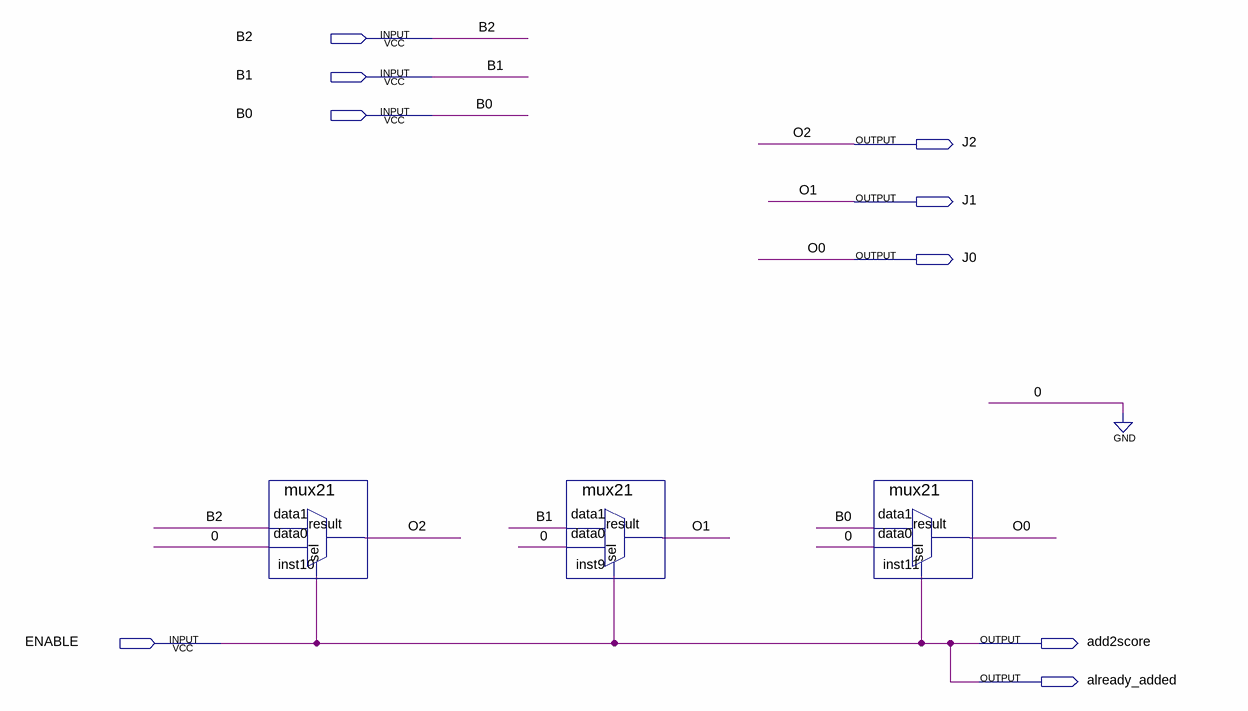
[diagram p0: schematic sheet]
// Quartus schematic add_or_not.bdf as structural Verilog: 3 symbols, 9 pins
module add_or_not (
  input  B2,
  input  B1,
  input  B0,
  input  ENABLE,
  output J2,
  output J1,
  output J0,
  output add2score,
  output already_added
);

  mux21 inst10 (.data1(B2), .data0(1'b0), .sel(ENABLE), .result(J2));
  mux21 inst9 (.data1(B1), .data0(1'b0), .sel(ENABLE), .result(J1));
  mux21 inst11 (.data1(B0), .data0(1'b0), .sel(ENABLE), .result(J0));

  assign add2score = ENABLE;
  assign already_added = ENABLE;

  // Other names for the same wires on the sheet: O0 = J0; O1 = J1; O2 = J2
endmodule
